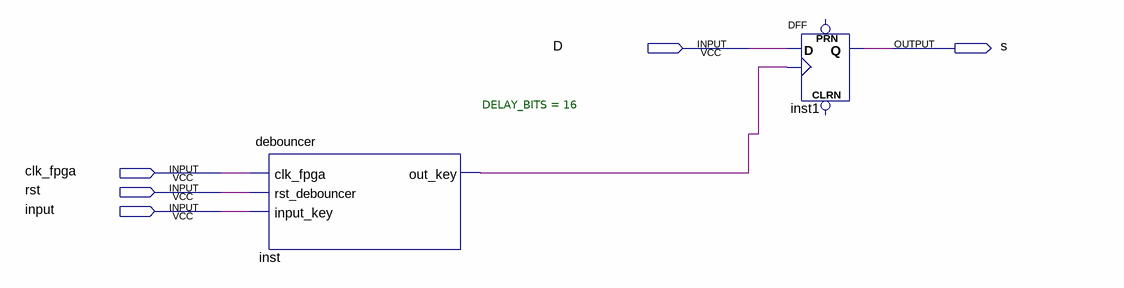
[diagram p0: schematic sheet]
// Quartus schematic Prince.bdf as structural Verilog: 2 symbols, 5 pins
module Prince (
  input  D,
  input  clk_fpga,
  input  rst,
  input  \input ,
  output s
);

  wire inst_out_key;

  debouncer #(.DELAY_BITS(16)) inst (
    .clk_fpga(clk_fpga), .rst_debouncer(rst), .input_key(\input ), .out_key(inst_out_key));
  DFF inst1 (.CLK(inst_out_key), .D(D), .Q(s));  // open: CLRN, PRN
endmodule
